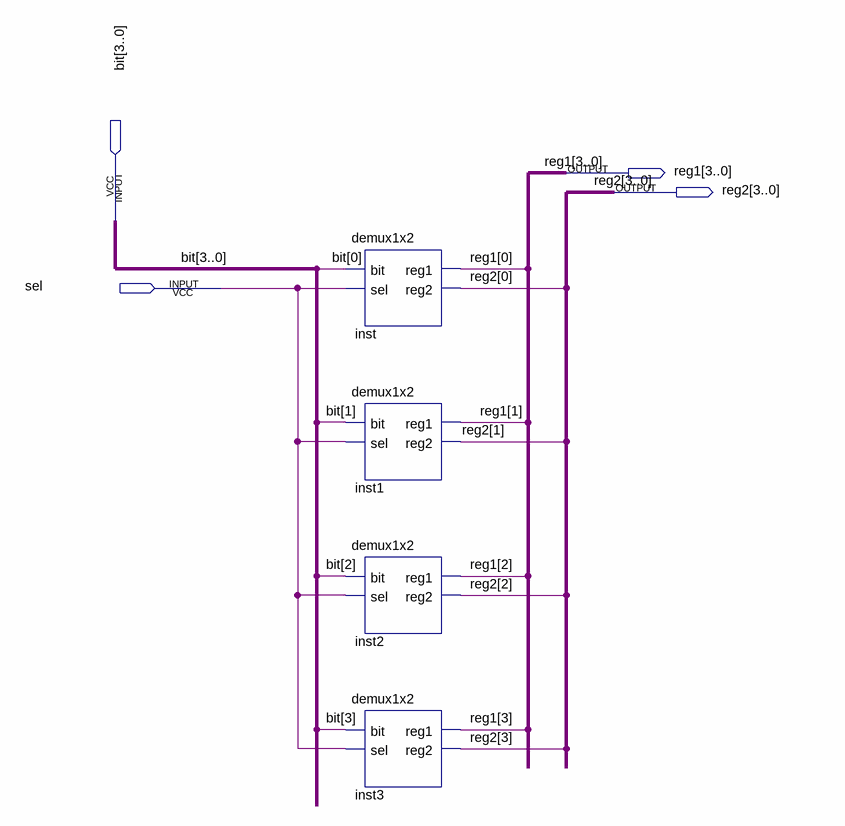
[diagram p0: schematic sheet]
// Quartus schematic demux4x8.bdf as structural Verilog: 4 symbols, 4 pins
module demux4x8 (
  input  [3:0] \bit ,
  input  sel,
  output [3:0] reg1,
  output [3:0] reg2
);

  demux1x2 inst (.\bit (\bit [0]), .sel(sel), .reg1(reg1[0]), .reg2(reg2[0]));
  demux1x2 inst1 (.\bit (\bit [1]), .sel(sel), .reg1(reg1[1]), .reg2(reg2[1]));
  demux1x2 inst2 (.\bit (\bit [2]), .sel(sel), .reg1(reg1[2]), .reg2(reg2[2]));
  demux1x2 inst3 (.\bit (\bit [3]), .sel(sel), .reg1(reg1[3]), .reg2(reg2[3]));
endmodule
